# Altium schematic sheet PSU.SchDoc: ROBOX V2 - Power Supply
size A4; DrawnBy: Jan Stappers; DocumentNumber: JSP016; Revision: B; SheetNumber: 4; SheetTotal: 6
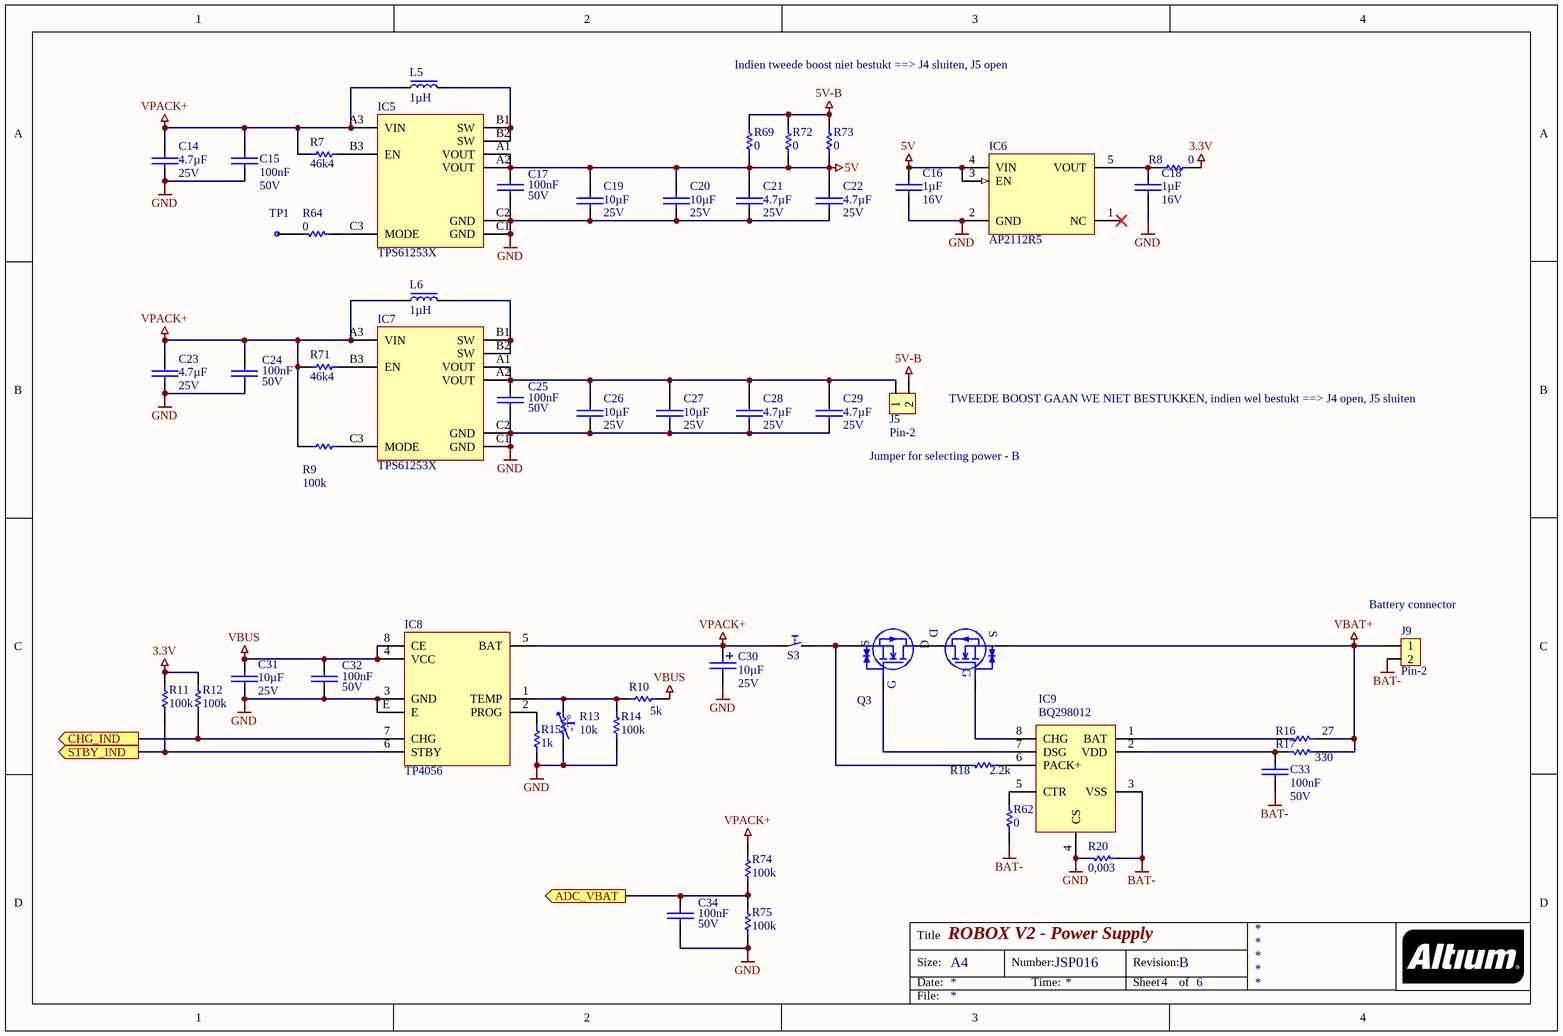
[diagram p0: PSU.SchDoc]

## Parts
C14  value 4.7µF  voltage: 25V  [C0805]  (hidden comment: cap_non_pol)
C15  value 100nF  voltage: 50V  [C0402]  (hidden comment: cap_non_pol)
C16  value 1µF  voltage: 16V  [C0402]  (hidden comment: cap_non_pol)
C17  value 100nF  voltage: 50V  [C0402]  (hidden comment: cap_non_pol)
C18  value 1µF  voltage: 16V  [C0402]  (hidden comment: cap_non_pol)
C19  value 10µF  voltage: 25V  [C0603]  (hidden comment: cap_non_pol)
C20  value 10µF  voltage: 25V  [C0603]  (hidden comment: cap_non_pol)
C21  value 4.7µF  voltage: 25V  [C0805]  (hidden comment: cap_non_pol)
C22  value 4.7µF  voltage: 25V  [C0805]  (hidden comment: cap_non_pol)
C23  value 4.7µF  voltage: 25V  [C0805]  (hidden comment: cap_non_pol)
C24  value 100nF  voltage: 50V  [C0402]  (hidden comment: cap_non_pol)
C25  value 100nF  voltage: 50V  [C0402]  (hidden comment: cap_non_pol)
C26  value 10µF  voltage: 25V  [C0603]  (hidden comment: cap_non_pol)
C27  value 10µF  voltage: 25V  [C0603]  (hidden comment: cap_non_pol)
C28  value 4.7µF  voltage: 25V  [C0805]  (hidden comment: cap_non_pol)
C29  value 4.7µF  voltage: 25V  [C0805]  (hidden comment: cap_non_pol)
C30  value 10µF  voltage: 25V  [CD6.3H12TH]  (hidden comment: cap-pol)
C31  value 10µF  voltage: 25V  [C0603]  (hidden comment: cap_non_pol)
C32  value 100nF  voltage: 50V  [C0402]  (hidden comment: cap_non_pol)
C33  value 100nF  voltage: 50V  [TH5.08]  (hidden comment: cap_non_pol)
C34  value 100nF  voltage: 50V  [C0402]  (hidden comment: cap_non_pol)
IC5  TPS61253X  [DSBGA-9]
IC6  AP2112R5  [SOT-89-5]
IC7  TPS61253X  [DSBGA-9]
IC8  TP4056  [SOIC-8-E]
IC9  BQ298012  [XFQFN-8]
J5  Pin-2  [2-PIN-EMPTY]
J9  Pin-2  [B075TZF7NN]
L5  value 1µH  [L4.2X4.2X2]  (hidden comment: inductor_1)
L6  value 1µH  [L4.2X4.2X2]  (hidden comment: inductor_1)
Q3  N_CH_MOSFET2_DUAL  [CSP-6]  (value not drawn)
R7  value 46k4  [R0402]  (hidden comment: resistor)
R8  value 0  [R0402]  (hidden comment: resistor)
R9  value 100k  [R0402]  (hidden comment: resistor)
R10  value 5k  [R0402]  (hidden comment: resistor)
R11  value 100k  [TH6.3]  (hidden comment: resistor)
R12  value 100k  [TH6.3]  (hidden comment: resistor)
R13  value 10k  [R0402]  (hidden comment: thermistor)
R14  value 100k  [R0402]  (hidden comment: resistor)
R15  value 1k  [R0402]  (hidden comment: resistor)
R16  value 27  [R0402]  (hidden comment: resistor)
R17  value 330  [R0402]  (hidden comment: resistor)
R18  value 2.2k  [R0402]  (hidden comment: resistor)
R20  value 0,003  [R2010]  (hidden comment: resistor)
R62  value 0  [R0402]  (hidden comment: resistor)
R64  value 0  [R0402]  (hidden comment: resistor)
R69  value 0  [R0402]  (hidden comment: resistor)
R71  value 46k4  [R0402]  (hidden comment: resistor)
R72  value 0  [R0402]  (hidden comment: resistor)
R73  value 0  [R0402]  (hidden comment: resistor)
R74  value 100k  [R0402]  (hidden comment: resistor)
R75  value 100k  [R0402]  (hidden comment: resistor)
S3  push-button  [ANT11SF1CQE]  (value not drawn)
TP1  TP  [TP_0.8MM]  (value not drawn)

## Ports
ADC_VBAT (out), CHG_IND (out), STBY_IND (out)

## Nets
3.3V: R8.1 R11.1 R12.1
5V: C16.1 C17.2 C19.1 C20.1 C21.1 C22.1 IC5.A1(VOUT) IC5.A2(VOUT) IC6.3(EN) IC6.4(VIN) R69.2 R72.2 R73.2
5V-B: J5.2 R69.1 R72.1 R73.1
BAT-: C33.2 IC9.3(VSS) J9.2 R20.2 R62.2
GND: C14.2 C15.2 C16.2 C17.1 C18.2 C19.2 C20.2 C21.2 C22.2 C23.2 C24.1 C25.1 C26.2 C27.2 C28.2 C29.2 C30.- C31.2 C32.1 C34.1 IC5.C1(GND) IC5.C2(GND) IC6.2(GND) IC7.C1(GND) IC7.C2(GND) IC8.3(GND) IC8.E IC9.4(CS) R13.1 R14.2 R15.2 R20.1 R75.2
VBAT+: J9.1 Q3.S R16.2 R17.2
VBUS: C31.1 C32.2 IC8.4(VCC) IC8.8(CE) R10.2
VPACK+: C14.1 C15.1 C23.1 C24.2 C30.+ IC5.A3(VIN) IC7.A3(VIN) IC8.5(BAT) L5.1 L6.1 R7.1 R9.2 R71.1 R74.1 S3.1
ADC_VBAT: C34.2 R74.2 R75.1 ; port ADC_VBAT
CHG_IND: IC8.7(CHG) R12.2 ; port CHG_IND
STBY_IND: IC8.6(STBY) R11.2 ; port STBY_IND
NetC18_1: C18.1 IC6.5(VOUT) R8.2
NetC25_2: C25.2 C26.1 C27.1 C28.1 C29.1 IC7.A1(VOUT) IC7.A2(VOUT) J5.1
NetC33_1: C33.1 IC9.2(VDD) R17.1
NetIC5_B1: IC5.B1(SW) IC5.B2(SW) L5.2
NetIC5_B3: IC5.B3(EN) R7.2
NetIC5_C3: IC5.C3(MODE) R64.1
NetIC7_B1: IC7.B1(SW) IC7.B2(SW) L6.2
NetIC7_B3: IC7.B3(EN) R71.2
NetIC7_C3: IC7.C3(MODE) R9.1
NetIC8_1: IC8.1(TEMP) R10.1 R13.2 R14.1
NetIC8_2: IC8.2(PROG) R15.1
NetIC9_1: IC9.1(BAT) R16.1
NetIC9_5: IC9.5(CTR) R62.1
NetIC9_6: IC9.6(PACK+) R18.2
NetIC9_7: IC9.7(DSG) Q3.G2
NetIC9_8: IC9.8(CHG) Q3.G
NetQ3_S2: Q3.S2 R18.1 S3.2
NetR64_2: R64.2 TP1.1

Not connected (* = marked no-connect by the designer): IC6 1(NC)*

## Notes on the sheet
- Indien tweede boost niet bestukt ==> J4 sluiten, J5 open
- (near J5) TWEEDE BOOST GAAN WE NIET BESTUKKEN, indien wel bestukt ==> J4 open, J5 sluiten
- Jumper for selecting power - B
- (near J9) Battery connector
- Title
- Size:
- Date:
- A4
- Number:
- Time:
- Revision:
- Sheet
- of
- File:
- (in symbol 1) -T°
- (in symbol 18) D

## Library data of the parts
C14 C21-C23 C28 C29 = 44: CAP CER 4.7UF 25V X5R 0805; manufacturer_ref: CL21A475KAQNNNE; manufacturer: Samsung Electro-Mechanics; id: 44; tolerance: 10%; dielectric: X5R; package: 0805; supplier_1: digikey; supplier_1_partnumber: 1276-1244-1-ND; price: 0,0374; status: active
C15 C17 C24 C25 C32 C34 = 0: CAP CER 0.1UF 50V X5R 0402; manufacturer_ref: 490-16356-1-ND; manufacturer: Murata Electronics; id: 0; tolerance: 5%; dielectric: X5R; package: 0402; supplier_1: digikey; supplier_1_partnumber: 490-16356-1-ND; price: 0,00933; status: non stock
C16 C18 = 5: CAP CER 1UF 16V X5R 0402; manufacturer_ref: CL05A105KO5NNNC; manufacturer: Samsung Electro-Mechanics; id: 5; tolerance: 10%; dielectric: X5R; package: 0402; supplier_1: digikey; supplier_1_partnumber: 1276-1067-1-ND; price: 0,00898; status: active
C19 C20 C26 C27 C31 = 1: CAP CER 10UF 25V X5R 10% SMD; manufacturer_ref: GRM188R61E106KA73D; manufacturer: Murata Electronics; id: 1; tolerance: 10%; dielectric: X5R; package: 0603; supplier_1: digikey; supplier_1_partnumber: 490-18214-1-ND; price: 0,06969; status: active
C30 = 6: CAP ALUM 10UF 20% 25V TH; manufacturer_ref: ECF1KM100E12OTPO; manufacturer: Yunxing; id: 6; dielectric: Aluminium; tolerance: 20%; package: d6,3h12TH; supplier_1: lcsc; supplier_1_partnumber: C2841587; price: 0,0229; status: active
C33 = 51: CAP CER TH 100nF X7R 50V; manufacturer_ref: C2761753; manufacturer: FH; id: 51; tolerance: 10%; dielectric: X7R; package: TH5.08; supplier_1: lcsc; supplier_1_partnumber: C385200; price: 0,0237; status: active
IC5 IC7 = 84: 3.8-MHZ, 5.25-V / 4-A BOOST CONV; manufacturer_ref: TPS61253E; manufacturer: Texas Instruments; id: 84; type: Power Supply DC/DC (BOOST); package: 9-DSBGA; supplier_1: digikey; supplier_1_partnumber: 296-TPS61253EYFFRCT-ND; price: 0,92; status: active
IC6 = 85: IC REG LINEAR 3.3V 600MA SOT89-5; manufacturer_ref: AP2112R5-3.3TRG1; manufacturer: Diodes Incorporated; id: 85; type: Power Supply LDO; package: SOT-89-5; supplier_1: digikey; supplier_1_partnumber: 31-AP2112R5-3.3TRG1CT-ND; status: active
IC8 = 89: IC ESOP-8 Battery Charger Management; manufacturer_ref: TP4056-42-ESOP8; manufacturer: TOPPOWER; id: 89; type: Power Supply (Bat Charg); package: 8-ESOP; supplier_1: lcsc; supplier_1_partnumber: C16581; price: 0,2165; status: active
IC9 = 94: IC BATT MON LI-ION 1CELL 8X2QFN; manufacturer: Texas Instruments; id: 94; manufacturer_ref: BQ298012; type: Power Supply (Bat Prot); package: 8-XFQFN; supplier_1: digikey; supplier_1_partnumber: 296-BQ298012RUGRCT-ND; status: active
J5 = 18: CONN TH solder pad; manufacturer_ref: TH-2; id: 18; nbr_positions_total: 2; package: Pin-2SR; price: 0
J9 = 59: CONN BAT 18650; manufacturer: KEESIN; id: 59; nbr_positions_total: 2; manufacturer_ref: B075TZF7NN; package: Pin-2SR; supplier_1: amazon; supplier_1_partnumber: B075TZF7NN; price: 0,978; status: active
L5 L6 = 14: FIXED IND 1UH 5.8A 26 MOHM SMD; manufacturer_ref: PA4332.102NLT; manufacturer: Pulse Electronics; id: 14; tolerance: 20%; current_rating: 5,8A; package: 4.2X4.2; supplier_1: digikey; supplier_1_partnumber: 553-3287-1-ND; price: 0,447; status: active
Q3 = 18: MOSFET 2N-CH 6CSP; manufacturer_ref: EFC8811R-TF; manufacturer: onsemi; id: 18; current_rating: 27A; voltage_vds: 12V; voltage_vgs_min: 1.3V; type: N channel; package: 6-SMD; supplier_1: digikey; supplier_1_partnumber: EFC8811R-TFOSCT-ND; status: active
R7 R71 = 39: RES SMD 46.4K OHM 1% 1/16W 0402; manufacturer_ref: AC0402FR-0746K4L; manufacturer: Yageo; id: 39; tolerance: 1%; power: 1/16W; package: 0402; supplier_1: digikey; supplier_1_partnumber: 13-AC0402FR-0746K4LCT-ND; price: 0,00296; status: active
R8 R62 R64 R69 R72 R73 = 8: RES SMD 0 OHM JUMPER 1/10W 0402; manufacturer_ref: ERJ-2GE0R00X; manufacturer: Panasonic Electronic Components; id: 8; tolerance: 1%; power: 1/10W; package: 0402; supplier_1: digikey; supplier_1_partnumber: P0.0JCT-ND; price: 0,00487; status: active
R9 R14 R74 R75 = 7: RES SMD 100K OHM 1% 1/10W 0402; manufacturer_ref: ERJ-2RKF1003X; manufacturer: Panasonic Electronic Components; id: 7; tolerance: 1%; power: 1/10W; package: 0402; supplier_1: digikey; supplier_1_partnumber: P100KLCT-ND; price: 0,00735; status: active
R10 = 53: RES SMD 5K OHM 1% 1/16W 0402; manufacturer_ref: RC0402FR-075KL; manufacturer: Yageo; id: 53; tolerance: 1%; power: 1/16W; package: 0402; supplier_1: digikey; supplier_1_partnumber: 13-RC0402FR-075KLCT-ND; price: 0,00255; status: active
R11 R12 = 83: RES TH 100k OHM 5% 1/4W; manufacturer_ref: CR1/4W-100K±5%-RT52; manufacturer: VO; id: 83; tolerance: 5%; power: 1/4W; package: TH6.3; supplier_1: lcsc; supplier_1_partnumber: C2894520; price: 0,0038; status: active
R13 = 1: THERMISTOR NTC 10KOHM 3380K 0402; manufacturer_ref: NCP15XH103F03RC; manufacturer: Murata Electronics; id: 1; tolerance: 1%; power: 1/10W; type: NTC_THERMISTOR; package: 0402; supplier_1: digikey; supplier_1_partnumber: 490-4801-1-ND; price: 0,04977; status: active
R15 = 0: RES SMD 1K OHM 1% 1/10W 0402; manufacturer_ref: ERJ-2RKF1001X; manufacturer: Panasonic Electronic Components; id: 0; tolerance: 1%; power: 1/10W; package: 0402; supplier_1: digikey; supplier_1_partnumber: P1.00KLCT-ND; price: 0,00855; status: active
R16 = 55: CRGCQ 0402 27R 1%; manufacturer_ref: CRGCQ0402F27R; manufacturer: TE Connectivity Passive Product; id: 55; power: 1/16W; tolerance: 1%; package: 0402; supplier_1: digikey; supplier_1_partnumber: A129608CT-ND; price: 0,00331; status: active
R17 = 21: RES SMD 330 OHM 1% 1/10W 0402; manufacturer_ref: ERJ-2RKF3300X; manufacturer: Panasonic Electronic Components; id: 21; tolerance: 1%; power: 1/10W; package: 0402; supplier_1: digikey; supplier_1_partnumber: P330LCT-ND; price: 0,00648; status: active
R18 = 52: RES 2.2K OHM 5% 1/16W 0402; manufacturer_ref: RMCF0402JT2K20; manufacturer: Stackpole Electronics Inc; id: 52; tolerance: 5%; power: 1/16W; package: 0402; supplier_1: digikey; supplier_1_partnumber: RMCF0402JT2K20CT-ND; price: 0,00182; status: active
R20 = 28: RES 0.003 OHM 1% 1.5W 2010; manufacturer_ref: CSNL2010FT3L00; manufacturer: Stackpole Electronics Inc; id: 28; power: 3/2W; tolerance: 1%; package: 2010; supplier_1: digikey; supplier_1_partnumber: CSNL2010FT3L00CT-ND; price: 0,15695; status: active
S3 = 3: SWITCH TOGGLE SPDT 5A 120V; manufacturer: CIT Relay and Switch; id: 3; manufacturer_ref: ANT11SF1CQE; package: ANT11SF1CQE; supplier_1: digikey; supplier_1_partnumber: 2449-ANT11SF1CQE-ND; price: 1,98; status: active
TP1 = 1: Test point diameter 0.6mm; manufacturer_ref: Test Point 0.8MM; id: 1; type: Test Point; package: Test Point 0.8MM; supplier_3: 0; supplier_3_partnumber: 0; price: 0